# Altium schematic sheet Comm_Interface.SchDoc: Control Interface
size A4; DocumentNumber: 3; SheetNumber: 3; SheetTotal: 8
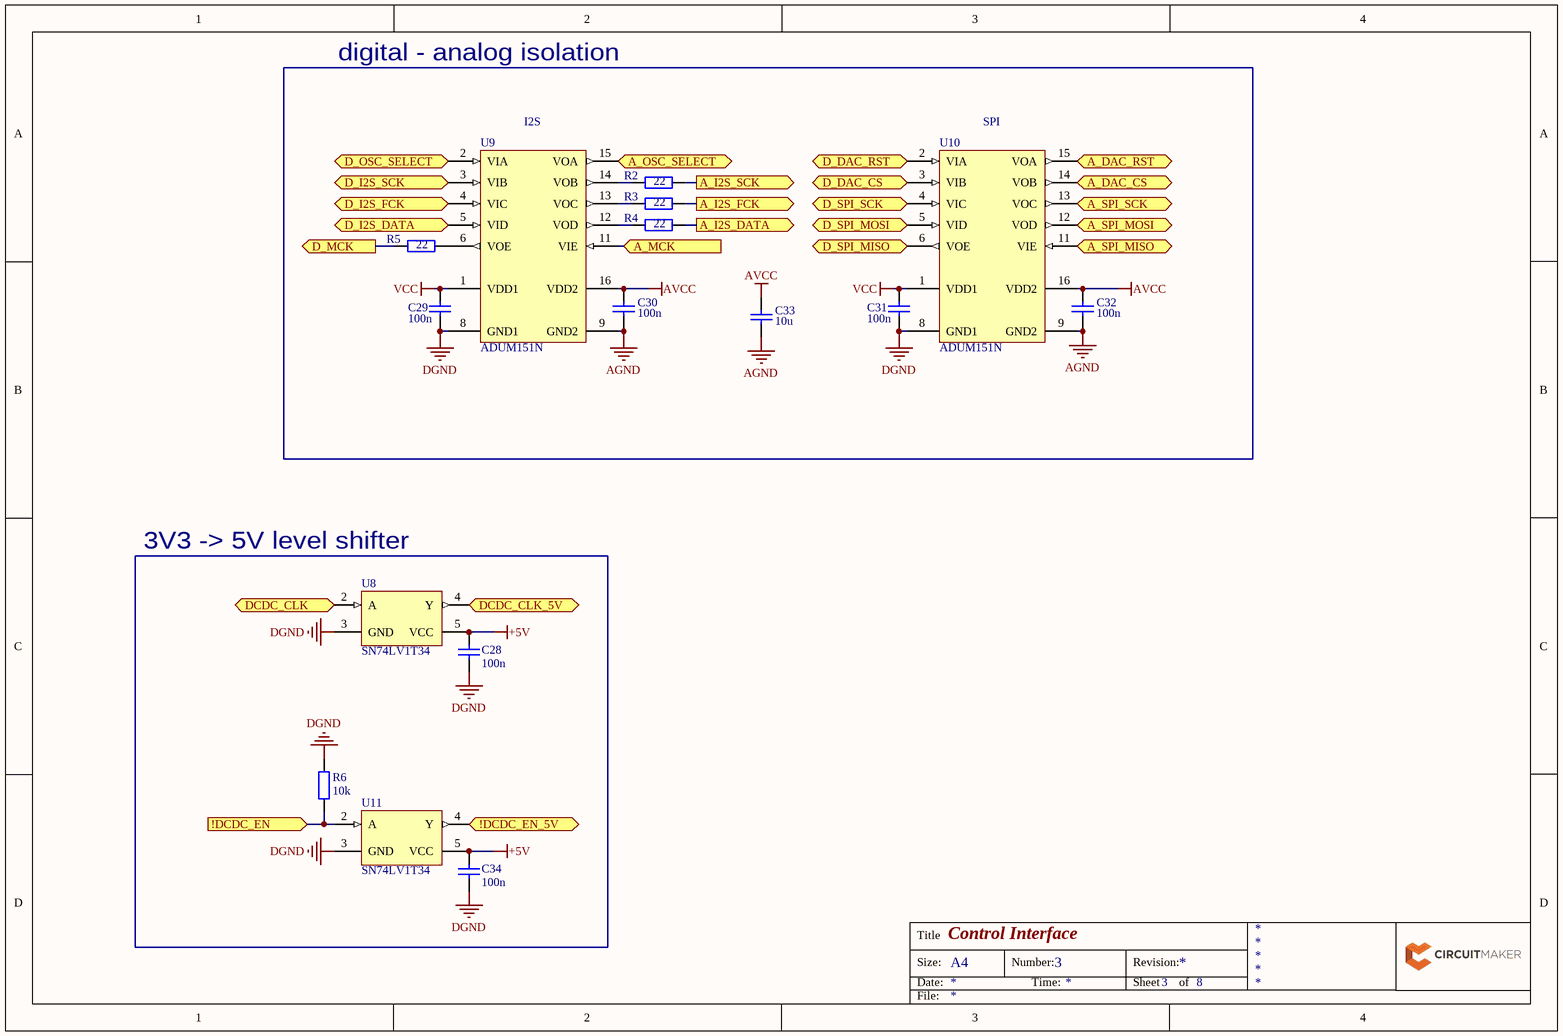
[diagram p0: Comm_Interface.SchDoc]

## Parts
C28  100n  [PCB-rf0pzaa82dpbeu9l4sxm-1]
C29  100n  [PCB-rf0pzaa82dpbeu9l4sxm-1]
C30  100n  [PCB-rf0pzaa82dpbeu9l4sxm-1]
C31  100n  [PCB-rf0pzaa82dpbeu9l4sxm-1]
C32  100n  [PCB-rf0pzaa82dpbeu9l4sxm-1]
C33  10u  [PCB-rf0pzaa82dpbeu9l4sxm-1]
C34  100n  [PCB-rf0pzaa82dpbeu9l4sxm-1]
R2  22  [PCB-3d5y3t7f8drf35yjcj59-1]
R3  22  [PCB-3d5y3t7f8drf35yjcj59-1]
R4  22  [PCB-3d5y3t7f8drf35yjcj59-1]
R5  22  [PCB-3d5y3t7f8drf35yjcj59-1]
R6  10k  [PCB-3d5y3t7f8drf35yjcj59-1]
U8  SN74LV1T34  [PCB-0ardthfs7lzl2yengne1-1]
U9  ADUM151N  [SOP16]
U10  ADUM151N  [SOP16]
U11  SN74LV1T34  [PCB-0ardthfs7lzl2yengne1-1]

## Blocks framed on the sheet
digital - analog isolation: C29-C33 R2-R5 U9 U10
3V3 -> 5V level shifter: C28 C34 R6 U8 U11

## Ports
!DCDC_EN (in), !DCDC_EN_5V (out), A_DAC_CS (out), A_DAC_RST (out), A_I2S_DATA (out), A_I2S_FCK (out), A_I2S_SCK (out), A_MCK (in), A_OSC_SELECT (out), A_SPI_MISO (in), A_SPI_MOSI (out), A_SPI_SCK (out), D_DAC_CS (in), D_DAC_RST (in), D_I2S_DATA (in), D_I2S_FCK (in), D_I2S_SCK (in), D_MCK (out), D_OSC_SELECT (in), D_SPI_MISO (out), D_SPI_MOSI (in), D_SPI_SCK (in), DCDC_CLK (in), DCDC_CLK_5V (out)

## Nets
+5V: C28.2 C34.2 U8.5(VCC) U11.5(VCC)
AGND: C30.1 C32.1 C33.1 U9.9(GND2) U10.9(GND2)
AVCC: C30.2 C32.2 C33.2 U9.16(VDD2) U10.16(VDD2)
DGND: C28.1 C29.1 C31.1 C34.1 R6.2 U8.3(GND) U9.8(GND1) U10.8(GND1) U11.3(GND)
VCC: C29.2 C31.2 U9.1(VDD1) U10.1(VDD1)
!DCDC_EN: R6.1 U11.2(A) ; port !DCDC_EN
!DCDC_EN_5V: U11.4(Y) ; port !DCDC_EN_5V
A_DAC_CS: U10.14(VOB) ; port A_DAC_CS
A_DAC_RST: U10.15(VOA) ; port A_DAC_RST
A_I2S_DATA: R4.1 ; port A_I2S_DATA
A_I2S_FCK: R3.1 ; port A_I2S_FCK
A_I2S_SCK: R2.1 ; port A_I2S_SCK
A_MCK: U9.11(VIE) ; port A_MCK
A_OSC_SELECT: U9.15(VOA) ; port A_OSC_SELECT
A_SPI_MISO: U10.11(VIE) ; port A_SPI_MISO
A_SPI_MOSI: U10.12(VOD) ; port A_SPI_MOSI
A_SPI_SCK: U10.13(VOC) ; port A_SPI_SCK
D_DAC_CS: U10.3(VIB) ; port D_DAC_CS
D_DAC_RST: U10.2(VIA) ; port D_DAC_RST
D_I2S_DATA: U9.5(VID) ; port D_I2S_DATA
D_I2S_FCK: U9.4(VIC) ; port D_I2S_FCK
D_I2S_SCK: U9.3(VIB) ; port D_I2S_SCK
D_MCK: R5.2 ; port D_MCK
D_OSC_SELECT: U9.2(VIA) ; port D_OSC_SELECT
D_SPI_MISO: U10.6(VOE) ; port D_SPI_MISO
D_SPI_MOSI: U10.5(VID) ; port D_SPI_MOSI
D_SPI_SCK: U10.4(VIC) ; port D_SPI_SCK
DCDC_CLK: U8.2(A) ; port DCDC_CLK
DCDC_CLK_5V: U8.4(Y) ; port DCDC_CLK_5V
NetR2_2: R2.2 U9.14(VOB)
NetR3_2: R3.2 U9.13(VOC)
NetR4_2: R4.2 U9.12(VOD)
NetR5_1: R5.1 U9.6(VOE)

## Notes on the sheet
- (near U9) I2S
- (near U10) SPI
- Title
- Size:
- Date:
- A4
- Number:
- Time:
- Revision:
- Sheet
- of
- File:

## Library data of the parts
C28-C34 = CMP-x8hddryxw4o380xfi98v-1: Capacitor 0603; CustomComponentID: x8hddryxw4o380xfi98v; LCSC Part #: C19702
  C28-C32 C34: LCSC Part #: C14663; LCSC Part #: C109474
R2-R6 = CMP-xcu3s4ikiffkkgbeyow5-1: Resistor 0603; CustomComponentID: xcu3s4ikiffkkgbeyow5
  R2-R5: LCSC Part #: C23345
  R6: LCSC Part #: C25804; LCSC Part #: C19702; LCSC Part #: C21190; LCSC Part #: C81598; LCSC Part #: C1546; LCSC Part #: C23265
U8 U11 = CMP-3a3bf2ca9c96e5fc-1: Single Power Supply BUFFER Logic Level Shifter (no enable) 5-SC70 -40 to 125; Manufacturer Part Number: SN74LV1T34DCKR; Lead-Free Status: Lead Free; Octopart URL: http://octopart.com/sn74lv1t34dckr-texas+instruments-33260491; Lifecycle Status: Active; RoHS: Compliant; OctopartID: 3a3bf2ca9c96e5fc
U9 U10 = CMP-8a0e4768d24455c9-3: Digital Isolator CMOS 5-CH 150Mbps 16-Pin SOIC N Tube; Lead-Free Status: Contains Lead; Number of Pins: 16; Octopart URL: https://octopart.com/adum151n0brz-analog+devices-74218796; RoHS: Compliant; Lifecycle Status: Pre-Release; OctopartID: 8a0e4768d24455c9; Operating Temperature: -40.0 °C (min); Packaging: Tube